# EAGLE design main (EAGLE 8.6.2)
AUTHOR: Mel McCalla; REV: 0.1
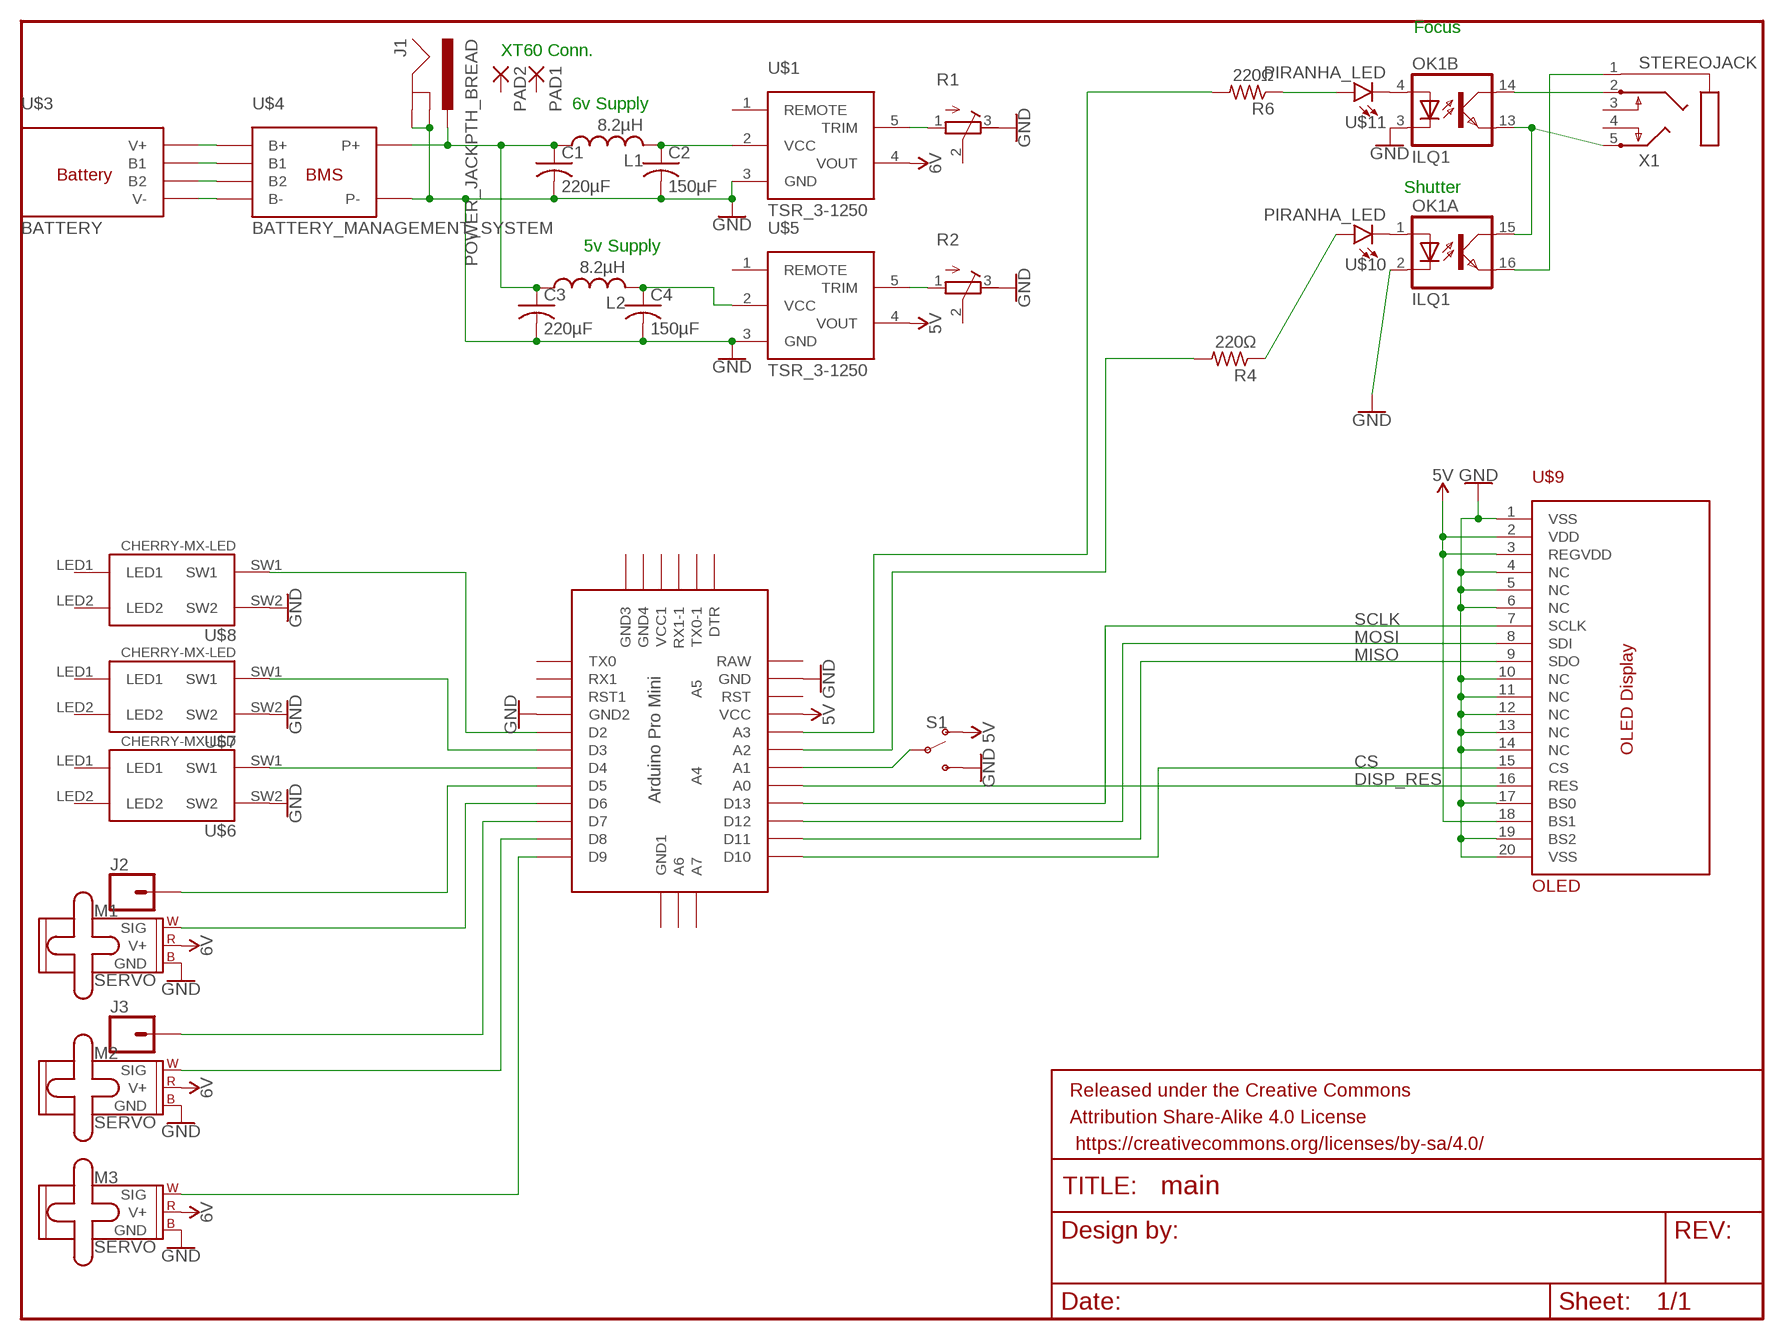
[diagram p0: schematic, sheet 1]

## Parts
C1  220µF  C-US075-032X103  [C075-032X103]
C2  150µF  C-US075-032X103  [C075-032X103]
C3  220µF  C-US075-032X103  [C075-032X103]
C4  150µF  C-US075-032X103  [C075-032X103]
FRAME1  FRAME-LETTER  [CREATIVE_COMMONS]
J1  POWER_JACKPTH_BREAD  [POWER_JACK_PTH_BREAD]
J2  CONN_01  [1X01]
J3  CONN_01  [1X01]
L1  8.2µH  L-USIRF-1  [IRF-1]
L2  8.2µH  L-USIRF-1  [IRF-1]
M1  SERVO  [1X03]
M2  SERVO  [1X03]
M3  SERVO  [1X03]
OK1  ILQ1  [DIL16]
PAD1  3,81/1,1  [3,81/1,1]
PAD2  3,81/1,1  [3,81/1,1]
R1  R-TRIMM64W  [RTRIM64W]
R2  R-TRIMM64W  [RTRIM64W]
R4  220Ω  R-US_0207/10  [0207/10]
R6  220Ω  R-US_0207/10  [0207/10]
S1  SWITCH-SPDT-PTH-11.6X4.0MM  [SWITCH_SPDT_PTH_11.6X4.0MM]
U$1  TSR_3-1250  [SIP-5]
U$2  ABK-PRO-MINI  [ABK-PRO-MINI]
U$3  BATTERY  (no package)
U$4  BATTERY_MANAGEMENT_SYSTEM  (no package)
U$5  TSR_3-1250  [SIP-5]
U$6  CHERRY-MX-LED  [CHERRY-MX-LED]
U$7  CHERRY-MX-LED  [CHERRY-MX-LED]
U$8  CHERRY-MX-LED  [CHERRY-MX-LED]
U$9  OLED  [SIP-20]
U$10  PIRANHA_LED  [LED_PIRANHA_5MM]
U$11  PIRANHA_LED  [LED_PIRANHA_5MM]
X1  STEREOJACK  [STX3100]

## Nets
5V: S1.1(O) U$2.VCC U$5.4(VOUT) U$9.2(VDD) U$9.3(REGVDD) U$9.18(BS1)
6V: M1.2(V+) M2.2(V+) M3.2(V+) U$1.4(VOUT)
BUTTON_1: U$2.D2 U$8.SW1
BUTTON_2: U$2.D3 U$7.SW1
BUTTON_3: U$2.D4 U$6.SW1
CS: U$2.D10 U$9.15(CS)
DISP_RES: U$2.A0 U$9.16(RES)
FOCUS: R6.2 U$2.A3
GND: C1.2 C2.2 C3.2 C4.2 J1.GND J1.GNDBREAK M1.3(GND) M2.3(GND) M3.3(GND) OK1.2(A:C) OK1.3(B:C) R1.3(E) R2.3(E) S1.3(S) U$1.3(GND) U$2.GND U$2.GND1(GND2) U$4.P- U$5.3(GND) U$6.SW2 U$7.SW2 U$8.SW2 U$9.1(VSS) U$9.4(NC) U$9.5(NC) U$9.6(NC) U$9.10(NC) U$9.11(NC) U$9.12(NC) U$9.13(NC) U$9.14(NC) U$9.17(BS0) U$9.19(BS2) U$9.20(VSS)
MISO: U$2.D11 U$9.9(SDO)
MODE_SWITCH: S1.2(P) U$2.A1
MOSI: U$2.D12 U$9.8(SDI)
N$1: U$3.V+ U$4.B+
N$2: U$3.B1 U$4.B1
N$3: U$3.B2 U$4.B2
N$4: OK1.14(B:COL) X1.2
N$5: OK1.16(A:EMIT) X1.1
N$6: OK1.4(B:A) U$11.+@0(C) U$11.+@1(C)
N$7: C2.1 L1.2 U$1.2(VCC)
N$8: R1.1(A) U$1.5(TRIM)
N$9: C4.1 L2.2 U$5.2(VCC)
N$10: R2.1(A) U$5.5(TRIM)
N$24: U$3.V- U$4.B-
N$26: R6.1 U$11.-@0(A) U$11.-@1(A)
N$27: R4.1 U$10.-@0(A) U$10.-@1(A)
N$29: OK1.1(A:A) U$10.+@0(C) U$10.+@1(C)
N$33: OK1.13(B:EMIT) OK1.15(A:COL) X1.5
P+: C1.1 C3.1 J1.PWR L1.1 L2.1 U$4.P+
SCLK: U$2.D13 U$9.7(SCLK)
SERVO_1_CONTROL: M1.1(SIG) U$2.D6
SERVO_1_FEEDBACK: J2.1 U$2.D5
SERVO_2_CONTROL: M2.1(SIG) U$2.D8
SERVO_2_FEEDBACK: J3.1 U$2.D7
SERVO_3_CONTROL: M3.1(SIG) U$2.D9
SHUTTER: R4.2 U$2.A2
Unconnected: OK1.5(C:A) OK1.6(C:C) OK1.7(D:C) OK1.8(D:A) OK1.9(D:EMIT) OK1.10(D:COL) OK1.11(C:COL) OK1.12(C:EMIT) PAD1.1(P) PAD2.1(P) R1.2(S) R2.2(S) U$1.1(REMOTE) U$2.A4 U$2.A5 U$2.A6 U$2.A7 U$2.DTR U$2.GND2(GND3) U$2.GND3(GND4) U$2.GND4(GND1) U$2.RAW U$2.RST U$2.RST1 U$2.RX1 U$2.RX1-1 U$2.TX0 U$2.TX0-1 U$2.VCC1 U$5.1(REMOTE) U$6.LED1 U$6.LED2 U$7.LED1 U$7.LED2 U$8.LED1 U$8.LED2 X1.3 X1.4

## Notes on the sheet
- Focus
- XT60 Conn.
- 6v Supply
- Shutter
- 5v Supply

## Library data of the parts
C1-C4 = rcl:C-US: CAPACITOR, American symbol; SPICEPREFIX: C
FRAME1 = SparkFun-Aesthetics:FRAME-LETTER: Schematic Frame - Letter Standard 8.5x11 US Letter frame
J1 = SparkFun-Connectors:POWER_JACK: Power Jack Connector This is the standard 5.5mm barrel jack for power. The PTH is the most common, proven, reliable, footprint. The Slot footprint only works if the mill layer is transmitted to the PCB fab house so be warned. Here are the connectors we sell at SparkFun: DC Barrel Power Jack/Connector <https://www.sparkfun.com/products/119> (PRT-00119) DC Barrel Power Jack/Connector (SMD) <https://www.sparkfun.com/products/12748> (PRT-12748) DC Barrel Jack Adapter - Breadboard Compatible <https://www.sparkfun.com/products/10811> (PRT-10811) It is used on this SparkFun product (and many, many others): SparkFun RedBoard - Programmed with Arduino <https://www.sparkfun.com/products/12757> (DEV-12757) Also, if you need a mating power supply or connector, please check these out: Wall Adapter Power Supply - 9VDC 650mA <https://www.sparkfun.com/products/298> (TOL-00298) DC Barrel Jack Adapter - Male <https://www.sparkfun.com/products/10287> (PRT-10287); PROD_ID: PRT-10811
J2 J3 = SparkFun-Connectors:CONN_01: Single connection point. Often used as Generic Header-pin footprint for 0.1 inch spaced/style header connections On any of the 0.1 inch spaced packages, you can populate with these: Break Away Headers - Straight <https://www.sparkfun.com/products/116> (PRT-00116) Break Away Male Headers - Right Angle <https://www.sparkfun.com/products/553> (PRT-00553) Female Headers <https://www.sparkfun.com/products/115> (PRT-00115) Break Away Headers - Machine Pin <https://www.sparkfun.com/products/117> (PRT-00117) Break Away Female Headers - Swiss Machine Pin <https://www.sparkfun.com/products/743> (PRT-00743) This device is also useful as a general connection point to wire up your design to another part of your project. Our various solder wires solder well into these plated through hole pads. Hook-Up Wire - Assortment (Stranded, 22 AWG) <https://www.sparkfun.com/products/11375> (PRT-11375) Hook-Up Wire - Assortment (Solid Core, 22 AWG) <https://www.sparkfun.com/products/11367> (PRT-11367) View the entire wire category on our website here <https://www.sparkfun.com/categories/141> Special notes: SMTSO-256-ET is a "flush mount" nut for a 4-40 screw. We mostly use this on specialty testbeds; it is a nice way to connect hardware to your PCB at an adjustable hieght. Also note, the SNAP packages are for using a snappable style connector. We sell a baggie of snaps and they are also used on two LilyPad designs: Snap Assortment - 30 pack (male and female) <https://www.sparkfun.com/products/11347> (DEV-11347) LilyPad Arduino SimpleSnap <https://www.sparkfun.com/products/10941> (DEV-10941) LilyPad SimpleSnap Protoboard <https://www.sparkfun.com/products/10940> (DEV-10940)
L1 L2 = rcl:L-US: INDUCTOR, American symbol; SPICEPREFIX: L
M1-M3 = SparkFun-Electromechanical:SERVO: Servo Motor 3-pin connector for a standard servo motor (voltage supply, ground, and control signal.) SparkFun Products Servo - Generic (Sub-Micro Size) <https://www.sparkfun.com/products/9065> (ROB-09065) Servo - Generic High Torque Continuous Rotation (Standard Size) <https://www.sparkfun.com/products/9347> (ROB-09347) Servo - Generic High Torque (Standard Size) <https://www.sparkfun.com/products/11965> (ROB-11965)
OK1 = optocoupler:ILQ1: SIEMENS OPTO COUPLER; MF: VISHAY/TELEFUNKEN; MPN: ILQ1; OC_FARNELL: 1469501; OC_NEWARK: 88K1954
PAD1 PAD2 = wirepad:3,81/1,1: THROUGH-HOLE PAD
R1 R2 = rcl:R-TRIMM: Trimm resistor; SPICEMODEL: X; SPICEPREFIXL: POT
R4 R6 = rcl:R-US_: RESISTOR, American symbol; SPICEPREFIX: R
S1 = SparkFun-Switches:SWITCH-SPDT: Single Pole, Double Throw (SPDT) Switch Single-pole, double-throw (SPDT) switch. Variant Overview SMD-AYZ0202 Surface Mount DPDT Switch <https://www.sparkfun.com/products/597> (COM-00597) Used on e.g. LilyPad Arduino USB - ATmega32U4 Board <https://www.sparkfun.com/products/12049> PTH-11.6X4.0MM SPDT Mini Power Switch <https://www.sparkfun.com/products/102> (COM-00102) Used on e.g. SparkFun Simon Says - Through-Hole Soldering Kit <https://www.sparkfun.com/products/10547> (KIT-10547) PTH-11.6X4.0MM-KIT KIT version of SPDT Mini Power Switch - Simplifies soldering by removing tStop of switch pins - only one side can be soldered. PTH-11.6X4.0MM-LOCK LOCK version of SPDT Mini Power Switch - Offset pins hold switch in place for easier soldering. SMD-RIGHT-ANGLE Surface Mount Right Angle Switch <https://www.sparkfun.com/products/10860> (COM-10860) Used on e.g. SparkFun ESP8266 Thing <https://www.sparkfun.com/products/13231>; PROD_ID: SWCH-08261; SF_SKU: COM-00102
U$1 U$5 = Mel_Custom:TSR_3-1250
U$2 = Arduino-clone:ABK-PRO-MINI: ABK Pro-Mini Arduino Clone
U$3 = Mel_Custom:BATTERY
U$4 = Mel_Custom:BATTERY_MANAGEMENT_SYSTEM
U$6-U$8 = cherrymx:CHERRY-MX-LED: Cherry MX series keyswitch with LED
U$9 = Mel_Custom:OLED
U$10 U$11 = Mel_Custom:PIRANHA_LED
X1 = adafruit:STEREOJACK: MIC/HEADPHONE JACK Stereo jack with two switches. Kycon STX3100, CUI SJ1-3555NG and/or 4UCon 05544

## Board
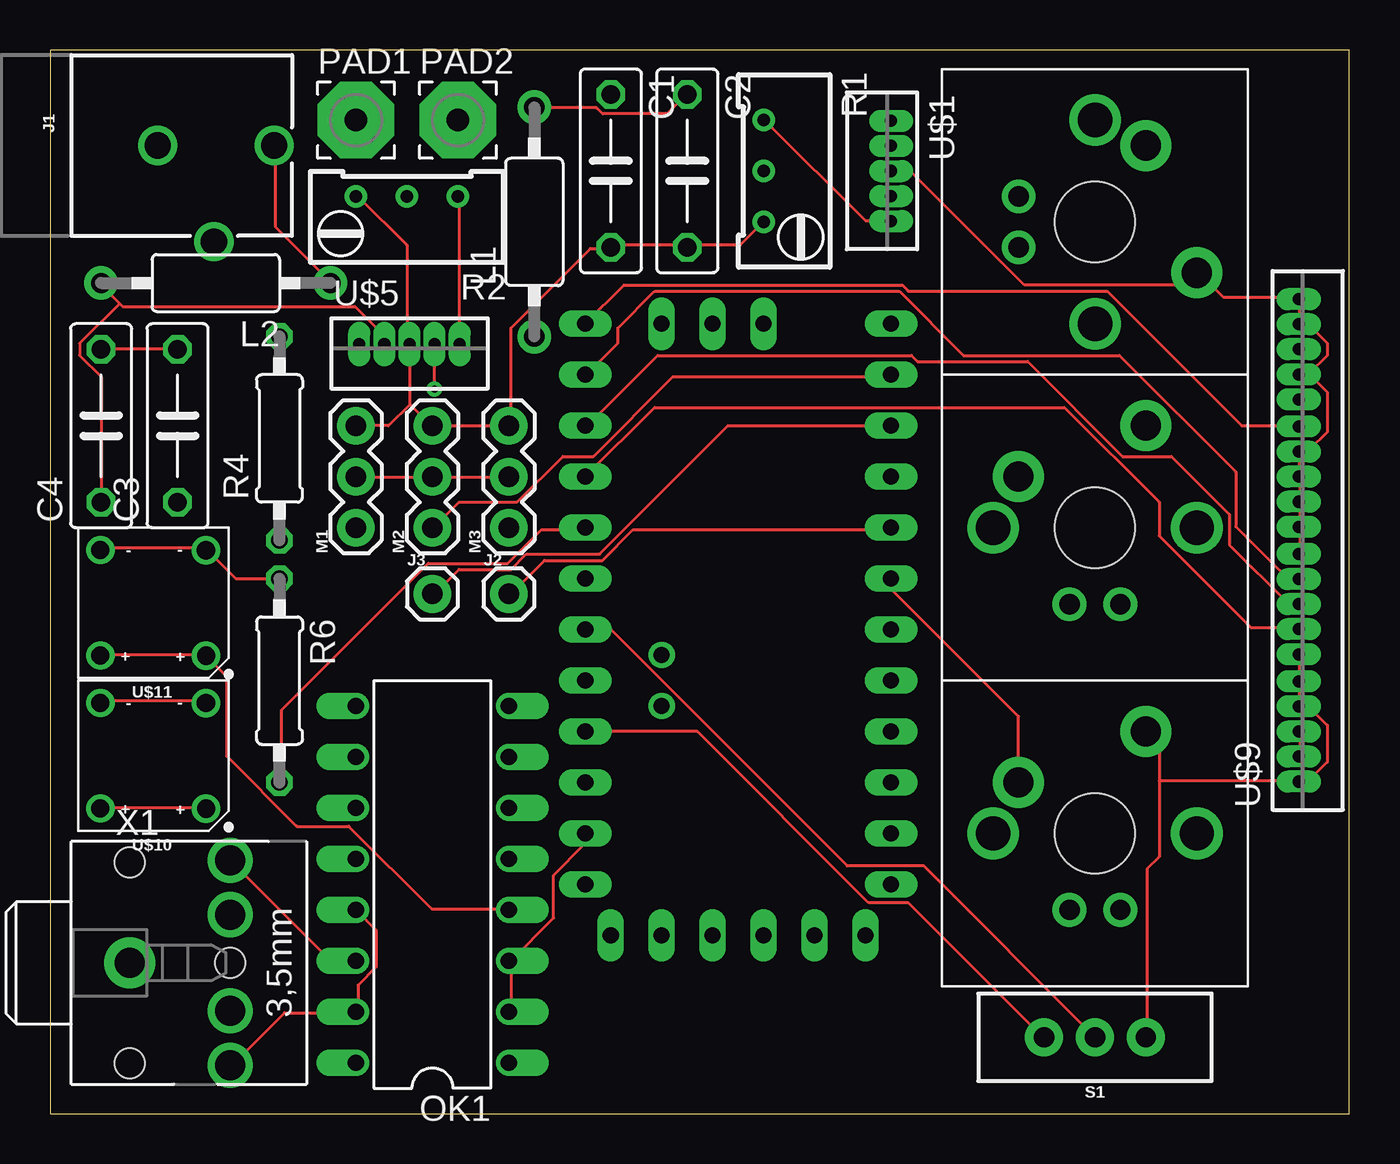
[diagram p1: board, top side]
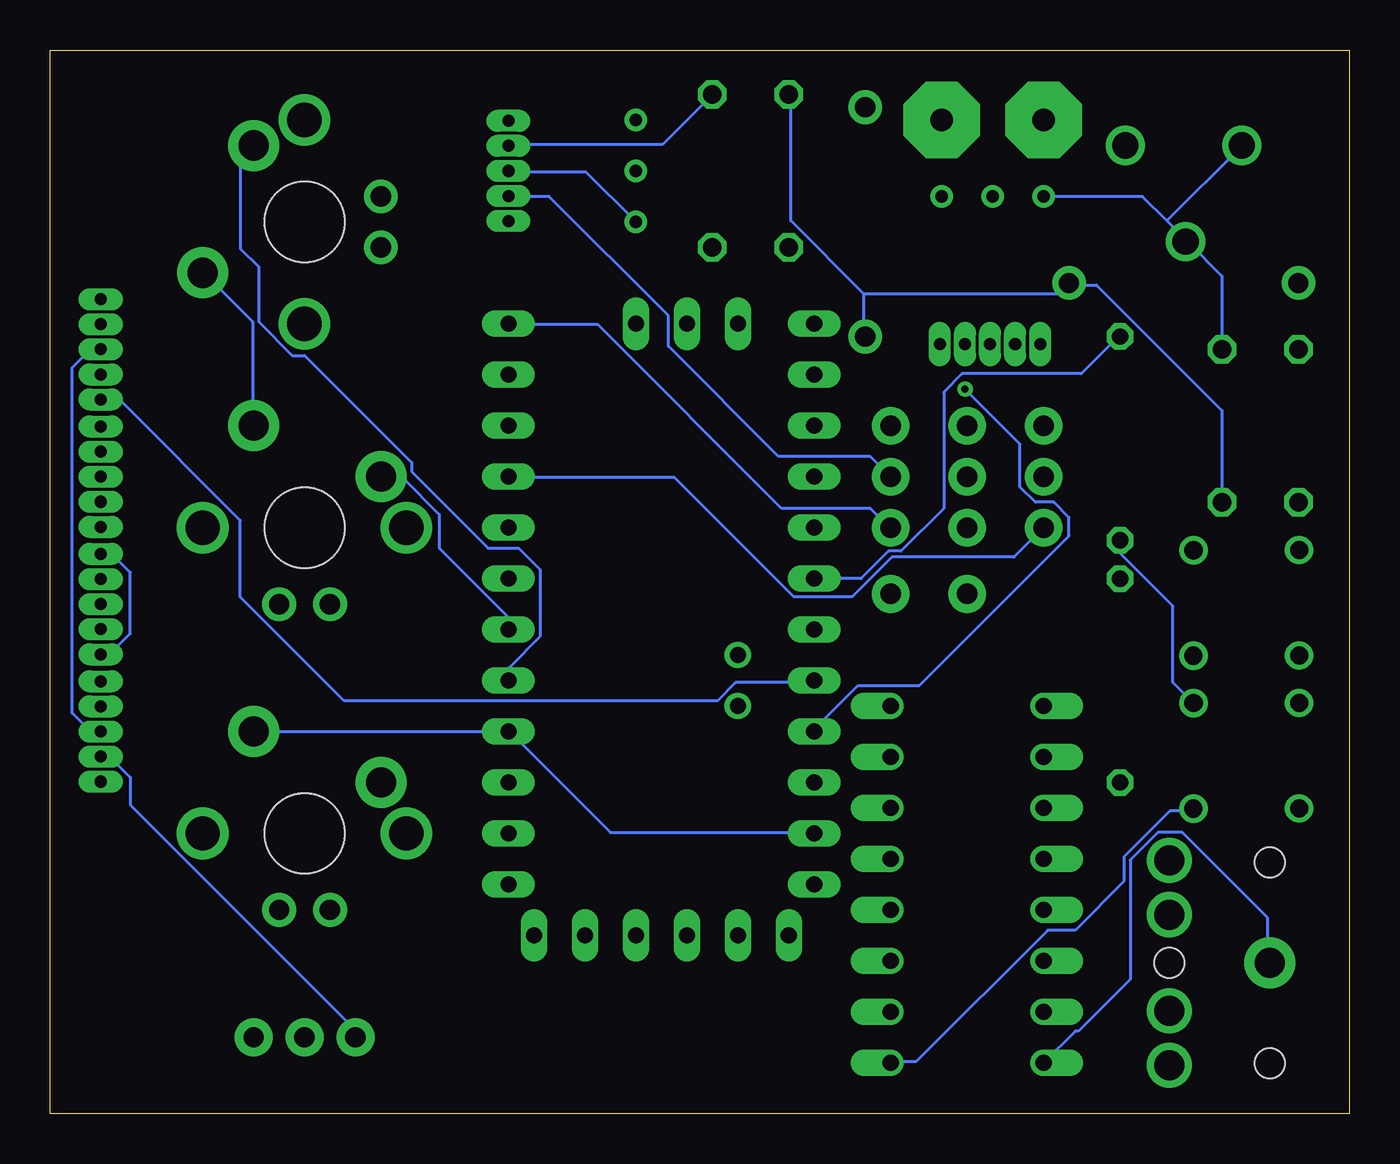
[diagram p2: board, bottom side, seen from below]

Size 64.75 x 53.01 mm. Coordinates in mm from the lower left corner, seen from the top.
Outline: 0,0 64.75,0 64.75,53.01 0,53.01 0,0
Copper layers (1*16): Top 0.035mm / dielectric 1.5mm / Bottom 0.035mm
Design rules "default": minimum track width 6mil, minimum drill 0.35mm, track to track 6mil, track to pad 6mil, pad to pad 6mil, via to via 6mil, smd to smd 6mil, copper to edge 40mil, drill to drill 6mil, minimum pad ring 10mil, minimum via ring 8mil, stop-mask expansion 4mil, vias tented up to drill 0mil, thermal gap 10mil

### Footprints (pad centres in the part's own frame; a part is rotated, then mirrored left to right if it is on the bottom)
C075-032X103 = drill 0.914 octagon: 1 -3.81,0; 2 3.81,0
POWER_JACK_PTH_BREAD = drill 1.3: GND 0,7.9; GNDBREAK 4.8,10.7; PWR 0,13.7
1X01 = drill 1.016 pad 1.88: 1 0,0
IRF-1 = drill 1 pad 1.676: 1 -5.715,0; 2 5.715,0
1X03 = drill 1.016 pad 1.88: 1 0,0; 2 2.54,0; 3 5.08,0
DIL16 = drill 0.813 offset: 1 -8.89,-3.81; 2 -6.35,-3.81; 3 -3.81,-3.81; 4 -1.27,-3.81; 5 1.27,-3.81; 6 3.81,-3.81; 7 6.35,-3.81; 8 8.89,-3.81; 9 8.89,3.81; 10 6.35,3.81; 11 3.81,3.81; 12 1.27,3.81; 13 -1.27,3.81; 14 -3.81,3.81; 15 -6.35,3.81; 16 -8.89,3.81
3,81/1,1 = drill 1.118 pad 3.81 octagon: 1 0,0
RTRIM64W = drill 0.61: 1 1.27,-2.54; 2 1.27,0; 3 1.27,2.54
0207/10 = drill 0.813 octagon: 1 -5.08,0; 2 5.08,0
SWITCH_SPDT_PTH_11.6X4.0MM = drill 1.016 pad 1.88: 1 0,2.54; 2 0,0; 3 0,-2.54
SIP-5 = drill 0.6 pad 0.7 long: 1 -2.5,0; 2 -1.25,0; 3 0,0; 4 1.25,0; 5 2.5,0
ABK-PRO-MINI = drill 0.8 long: A0 10.16,-3.81; A1 10.16,-6.35; A2 10.16,-8.89; A3 10.16,-11.43; A6 3.81,-21.59; A7 6.35,-21.59; D2 -5.08,-3.81; D3 -5.08,-6.35; D4 -5.08,-8.89; D5 -5.08,-11.43; D6 -5.08,-13.97; D7 -5.08,-16.51; D8 -5.08,-19.05; D9 -5.08,-21.59; D10 10.16,-21.59; D11 10.16,-19.05; D12 10.16,-16.51; D13 10.16,-13.97; DTR 8.89,8.89; GND 10.16,3.81; GND1 -5.08,-1.27; GND2 -3.81,8.89; GND3 -1.27,8.89; GND4 1.27,-21.59; RAW 10.16,6.35; RST 10.16,1.27; RST1 -5.08,1.27; RX1 -5.08,3.81; RX1-1 3.81,8.89; TX0 -5.08,6.35; TX0-1 6.35,8.89; VCC 10.16,-1.27; VCC1 1.27,8.89 | drill 0.8: A4 6.35,-5.08; A5 6.35,-2.54
CHERRY-MX-LED = drill 1.016 pad 1.676: LED1 -1.27,-3.81; LED2 1.27,-3.81 | drill 1.714 pad 1.93: P$3 -5.08,0; P$4 5.08,0 | drill 1.5 pad 2.54: SW1 -3.81,2.54; SW2 2.54,5.08 | hole 4: 0,0
SIP-20 = drill 0.6 pad 0.7 long: 1 -2.5,0; 2 -1.25,0; 3 0,0; 4 1.25,0; 5 2.5,0; 6 3.85,0; 7 5.1,0; 8 6.35,0; 9 7.6,0; 10 8.85,0; 11 10.2,0; 12 11.45,0; 13 12.7,0; 14 13.95,0; 15 15.2,0; 16 16.55,0; 17 17.8,0; 18 19.05,0; 19 20.3,0; 20 21.55,0
LED_PIRANHA_5MM = drill 0.9: +@0 -2.688,2.574; +@1 2.575,2.562; -@0 -2.684,-2.684; -@1 2.579,-2.696
STX3100 = drill 1.5 pad 2.54: 1 2.7,-0.1 | drill 1.5: 2 7.7,5; 3 7.7,2.3; 4 7.7,-2.5; 5 7.7,-5.2 | hole 1.5: 2.7,4.9; 2.7,-5.1; 7.7,-0.1

### Placement (x,y rotation side)
C1  27.94,46.99 270 top
C2  31.75,46.99 270 top
C3  6.35,34.29 90 top
C4  2.54,34.29 90 top
FRAME1  12.7,-17.78 0 top  (outside the outline)
J1  -2.54,48.26 270 top
J2  22.86,25.91 0 top
J3  19.05,25.91 0 top
L1  24.13,44.45 90 top
L2  8.26,41.4 180 top
M1  15.24,29.21 90 top
M2  19.05,29.21 90 top
M3  22.86,29.21 90 top
OK1  19.05,11.43 90 top
PAD1  15.24,49.53 0 top
PAD2  20.32,49.53 0 top
R1  36.83,46.99 180 top
R2  17.78,44.45 90 top
R4  11.43,33.66 90 top
R6  11.43,21.59 270 top
S1  52.07,3.81 90 top
U$1  41.91,46.99 270 top
U$2  36.83,17.78 180 top
U$5  17.91,38.35 0 top
U$6  52.07,13.97 0 top
U$7  52.07,29.21 0 top
U$8  52.07,44.45 270 top
U$9  62.23,19.05 90 top
U$10  5.08,17.78 180 top
U$11  5.08,25.4 180 top
X1  1.27,7.62 0 top

### Tracks (layer width: path | path; a pad name or v marks a point on that pad's centre or on a via)
5V  (via drill 0.35)
  Top 0.152: v19.15,36.12 19.15,38.25 U$5.4 | U$9.2 62.28,17.83 62.28,19.05 U$9.3 | U$2.VCC 32.26,19.05 40.79,10.52 42.77,10.52 49.48,3.81 S1.1
  Bottom 0.152: v19.15,36.12 16.41,33.38 16.41,31.24 15.65,30.48 14.73,30.48 13.97,29.72 13.97,28.8 21.44,21.34 24.49,21.34 26.77,19.05 U$2.VCC | U$9.18 62.74,38.1 63.65,37.19 63.65,19.96 62.74,19.05 U$9.3 | S1.1 49.63,3.81 49.63,4.27 60.76,15.39 60.76,16.76 61.67,17.68 62.13,17.68 U$9.2
6V
  Top 0.152: M1.2 15.34,31.7 19,31.7 M2.2 19.15,31.7 22.81,31.7 M3.2
  Bottom 0.152: M3.2 23.88,32.77 28.45,32.77 33.93,38.25 33.93,39.78 39.88,45.72 41.86,45.72 U$1.4
BUTTON_1
  Bottom 0.152: U$2.D2 41.86,21.64 41.86,22.25 40.34,23.77 40.34,27.13 41.4,28.19 42.93,28.19 46.74,32 46.74,32.46 52.07,37.8 52.68,37.8 54.36,39.47 54.36,42.22 55.27,43.13 55.27,47.55 54.66,48.16 U$8.SW1
BUTTON_2
  Bottom 0.152: U$2.D3 42.01,24.23 42.01,24.84 45.36,28.19 45.36,29.87 47.19,31.7 48.26,31.7 U$7.SW1
BUTTON_3
  Top 0.152: U$6.SW1 48.26,19.81 42.01,26.06 42.01,26.67 U$2.D4
CS
  Top 0.152: U$2.D10 28.6,41.3 42.47,41.3 42.77,41 52.68,41 59.39,34.29 62.13,34.29 U$9.15
DISP_RES
  Bottom 0.152: U$9.16 62.13,35.51 61.21,35.51 55.27,29.57 55.27,25.76 50.09,20.57 31.5,20.57 30.58,21.49 26.77,21.49 U$2.A0
FOCUS
  Top 0.152: U$2.A3 26.62,29.11 24.49,29.11 22.81,27.43 18.85,27.43 11.53,20.12 11.53,16.61 R6.2
GND
  Top 0.152: R1.3 34.39,43.28 31.8,43.28 C2.2 31.65,43.28 27.99,43.28 C1.2 27.84,43.13 26.92,43.13 22.96,39.17 22.96,34.29 M3.3 M2.3 19,34.29 17.93,35.36 | 17.93,35.36 17.93,38.25 U$5.3 17.78,38.41 17.78,43.28 15.34,45.72 R2.3 | M1.3 16.87,34.29 17.93,35.36 | C3.2 C4.2 | U$9.10 62.28,28.04 62.28,29.11 U$9.11 62.28,29.26 62.28,30.48 U$9.12 62.28,30.63 62.28,31.7 U$9.13 62.28,31.85 62.28,32.92 U$9.14 62.28,33.07 62.74,33.07 63.65,33.98 63.65,35.97 62.74,36.88 | 62.74,36.88 62.28,36.88 U$9.17 62.74,36.88 | 62.74,36.88 63.65,37.8 63.65,38.41 62.74,39.32 62.28,39.32 U$9.19 62.28,39.47 62.28,40.54 U$9.20 62.13,40.69 58.47,40.69 57.25,41.91 U$8.SW2 57.1,41.91 56.49,41.3 48.57,41.3 42.93,46.94 42.01,46.94 U$1.3 | 22.96,7.62 25.1,9.75 25.1,11.89 26.62,13.41 26.62,13.87 U$2.GND | 22.96,7.62 22.96,5.18 OK1.2 | 22.96,7.62 OK1.3 | U$9.6 62.28,22.86 62.28,21.64 U$9.5 62.28,21.49 62.28,20.42 U$9.4 62.28,20.27 62.74,20.27 63.65,19.36 63.65,17.53 62.74,16.61 62.28,16.61 U$9.1 62.13,16.61 55.27,16.61 | 55.27,16.61 55.27,18.44 54.66,19.05 U$6.SW2 | 55.27,16.61 55.27,12.8 54.66,12.19 54.66,3.81 S1.3
  Bottom 0.152: R1.3 38.05,46.94 41.86,46.94 U$1.3 | R2.3 10.31,45.72 9.09,44.5 | 9.09,44.5 8.18,43.59 J1.GNDBREAK 8.03,43.43 6.35,41.76 C3.2 | 9.09,44.5 5.44,48.16 J1.GND | U$7.SW2 54.66,34.29 54.66,39.47 57.1,41.91 U$8.SW2 | U$6.SW2 U$2.GND1 41.86,19.05 36.83,14.02 26.77,14.02 U$2.GND | U$9.10 62.13,27.89 61.67,27.89 60.76,26.98 60.76,23.93 61.67,23.01 62.13,23.01 U$9.6
MISO
  Top 0.152: U$9.9 62.13,26.67 61.67,26.67 59.08,29.26 59.08,32 53.29,37.8 45.52,37.8 42.32,41 30.12,41 28.3,39.17 28.3,38.41 26.77,36.88 U$2.D11
MODE_SWITCH
  Top 0.152: S1.2 43.54,12.34 39.73,12.34 27.99,24.08 26.77,24.08 U$2.A1
MOSI
  Top 0.152: U$9.8 62.13,25.45 61.67,25.45 58.78,28.35 58.78,29.87 55.88,32.77 53.44,32.77 48.72,37.49 43.23,37.49 42.93,37.8 30.28,37.8 26.77,34.29 U$2.D12
N$4
  Top 0.152: OK1.14 13.97,7.62 X1.2
N$5
  Bottom 0.152: OK1.16 13.67,4.11 13.51,4.11 10.92,6.71 10.92,12.65 9.55,14.02 8.33,14.02 4.06,9.75 4.06,7.62 X1.1
N$6
  Top 0.152: OK1.4 22.81,10.21 19,10.21 14.88,14.33 12.29,14.33 8.79,17.83 8.79,21.79 7.87,22.71 U$11.+@0 7.72,22.86 2.54,22.86 U$11.+@1
N$7
  Top 0.152: L1.2 24.18,50.14 27.23,50.14 27.53,49.84 30.73,49.84 31.65,50.75 C2.1
  Bottom 0.152: C2.1 34.24,48.31 41.86,48.31 U$1.2
N$8
  Top 0.152: U$1.5 41.86,44.5 40.64,44.5 35.61,49.53 R1.1
N$9
  Top 0.152: 3.45,40.39 2.54,41.3 L2.2 | 3.45,40.39 3.61,40.23 15.19,40.23 16.56,38.86 16.56,38.41 U$5.2 | C4.1 2.54,36.73 1.47,37.8 1.47,38.41 3.45,40.39
N$10
  Top 0.152: U$5.5 20.37,38.41 20.37,45.72 R2.1
N$26
  Top 0.152: R6.1 9.25,26.67 7.87,28.04 U$11.-@0 7.72,28.19 2.54,28.19 U$11.-@1
N$27
  Top 0.152: U$10.-@1 2.54,20.57 7.72,20.57 U$10.-@0
  Bottom 0.152: U$10.-@0 8.79,21.49 8.79,25.3 11.38,27.89 11.38,28.5 R4.1
N$29
  Top 0.152: U$10.+@1 2.54,15.24 7.72,15.24 U$10.+@0
  Bottom 0.152: OK1.1 22.81,2.59 21.59,2.59 15.04,9.14 13.67,9.14 11.23,11.58 11.23,12.8 8.94,15.09 7.87,15.09 U$10.+@0
N$33
  Top 0.152: OK1.13 16.26,9.14 16.26,7.31 15.34,6.4 15.34,5.18 OK1.15 15.19,5.03 11.68,5.03 9.09,2.44 X1.5
P+
  Top 0.152: J1.PWR 11.23,48.16 11.23,44.2 13.97,41.45 L2.1
  Bottom 0.152: 24.18,40.84 27.84,44.5 27.84,50.75 C1.1 | 24.18,40.84 24.18,38.86 L1.1 | C3.1 6.35,35.05 12.6,41.3 13.97,41.3 | 24.18,40.84 14.43,40.84 13.97,41.3 | 13.97,41.3 L2.1
SCLK
  Top 0.152: U$2.D13 30.12,35.2 50.55,35.2 55.27,30.48 55.27,28.8 59.84,24.23 62.13,24.23 U$9.7
SERVO_1_CONTROL
  Bottom 0.152: M1.1 16.71,27.74 22.81,27.74 24.79,25.76 27.69,25.76 33.63,31.7 41.86,31.7 U$2.D6
SERVO_1_FEEDBACK
  Top 0.152: U$2.D5 41.86,29.11 29.06,29.11 27.53,27.58 24.64,27.58 22.96,25.91 J2.1
SERVO_2_CONTROL
  Top 0.152: U$2.D8 41.86,36.73 31.04,36.73 27.08,32.77 25.55,32.77 23.27,30.48 20.37,30.48 19.15,29.26 M2.1
SERVO_2_FEEDBACK
  Top 0.152: U$2.D7 33.78,34.29 27.38,27.89 23.72,27.89 22.96,27.13 20.37,27.13 19.15,25.91 J3.1
SERVO_3_CONTROL
  Bottom 0.152: U$2.D9 41.86,39.32 37.44,39.32 28.3,30.18 23.88,30.18 22.96,29.26 M3.1
SHUTTER
  Bottom 0.152: U$2.A2 24.33,26.67 22.96,28.04 22.35,28.04 20.22,30.18 20.22,35.97 19.3,36.88 13.36,36.88 11.53,38.71 R4.2